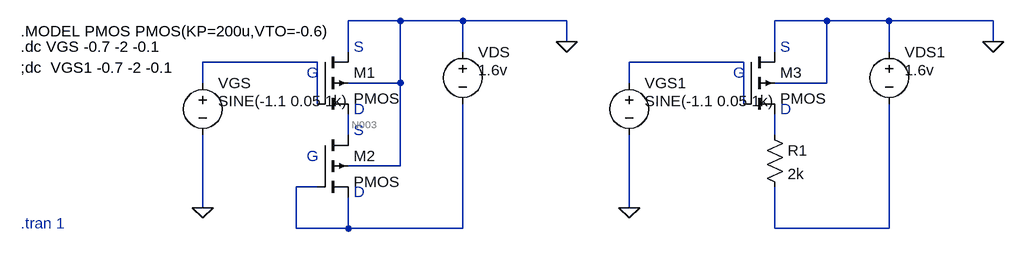
[diagram p0: schematic pmos-pmos.asc]
pmos-pmos.asc, the LTspice schematic file:
Version 4
SHEET 1 1188 680
WIRE 256 -16 176 -16
WIRE 352 -16 256 -16
WIRE 512 -16 352 -16
WIRE 912 -16 832 -16
WIRE 1008 -16 912 -16
WIRE 1168 -16 1008 -16
WIRE 512 16 512 -16
WIRE 1168 16 1168 -16
WIRE 176 32 176 -16
WIRE 352 32 352 -16
WIRE 832 32 832 -16
WIRE 1008 32 1008 -16
WIRE 128 48 -48 48
WIRE 784 48 608 48
WIRE -48 80 -48 48
WIRE 256 80 256 -16
WIRE 256 80 176 80
WIRE 608 80 608 48
WIRE 912 80 912 -16
WIRE 912 80 832 80
WIRE 128 112 128 48
WIRE 784 112 784 48
WIRE 176 160 176 128
WIRE 832 160 832 128
WIRE 256 208 256 80
WIRE 256 208 176 208
WIRE 128 240 96 240
WIRE -48 272 -48 160
WIRE 608 272 608 160
WIRE 96 304 96 240
WIRE 176 304 176 256
WIRE 176 304 96 304
WIRE 352 304 352 112
WIRE 352 304 176 304
WIRE 832 304 832 240
WIRE 1008 304 1008 112
WIRE 1008 304 832 304
FLAG -48 272 0
FLAG 512 16 0
FLAG 608 272 0
FLAG 1168 16 0
SYMBOL voltage 352 16 R0
WINDOW 123 0 0 Left 0
WINDOW 39 0 0 Left 0
WINDOW 3 24 44 Left 2
SYMATTR Value 1.6v
SYMATTR InstName VDS
SYMBOL voltage -48 64 R0
WINDOW 123 0 0 Left 0
WINDOW 39 0 0 Left 0
WINDOW 3 24 44 Left 2
SYMATTR Value SINE(-1.1 0.05 1k)
SYMATTR InstName VGS
SYMBOL pmos4 128 32 R0
SYMATTR InstName M1
SYMATTR Value2 l=1u w=10u
SYMBOL pmos4 128 160 R0
SYMATTR InstName M2
SYMATTR Value2 l=1u w=10u
SYMBOL voltage 1008 16 R0
WINDOW 123 0 0 Left 0
WINDOW 39 0 0 Left 0
WINDOW 3 24 44 Left 2
SYMATTR Value 1.6v
SYMATTR InstName VDS1
SYMBOL voltage 608 64 R0
WINDOW 123 0 0 Left 0
WINDOW 39 0 0 Left 0
WINDOW 3 24 44 Left 2
SYMATTR Value SINE(-1.1 0.05 1k)
SYMATTR InstName VGS1
SYMBOL pmos4 784 32 R0
SYMATTR InstName M3
SYMATTR Value2 l=1u w=10u
SYMBOL res 816 144 R0
SYMATTR InstName R1
SYMATTR Value 2k
TEXT 184 120 Left 2 ;D
TEXT 112 64 Left 2 ;G
TEXT 184 24 Left 2 ;S
TEXT -328 0 Left 2 !.MODEL PMOS PMOS(KP=200u,VTO=-0.6)
TEXT -328 24 Left 2 !.dc VGS -0.7 -2 -0.1
TEXT -328 296 Left 2 ;.tran 1
TEXT 184 248 Left 2 ;D
TEXT 112 192 Left 2 ;G
TEXT 184 152 Left 2 ;S
TEXT 840 120 Left 2 ;D
TEXT 768 64 Left 2 ;G
TEXT 840 24 Left 2 ;S
TEXT -328 56 Left 2 !;dc  VGS1 -0.7 -2 -0.1

The netlist it stands for:
* pmos-pmos.asc
VDS 0 N005 1.6v
VGS N001 0 SINE(-1.1 0.05 1k)
M1 0 N001 N003 0 PMOS l=1u w=10u
M2 N003 N005 N005 0 PMOS l=1u w=10u
VDS1 0 N006 1.6v
VGS1 N002 0 SINE(-1.1 0.05 1k)
M3 0 N002 N004 0 PMOS l=1u w=10u
R1 N004 N006 2k
.model NMOS NMOS
.model PMOS PMOS
.lib standard.mos
* D
* G
* S
.MODEL PMOS PMOS(KP=200u,VTO=-0.6)
.dc VGS -0.7 -2 -0.1
* .tran 1
* D
* G
* S
* D
* G
* S
;dc  VGS1 -0.7 -2 -0.1
.backanno
.end

* Results of the author's LTspice run, read from the files saved beside the schematic
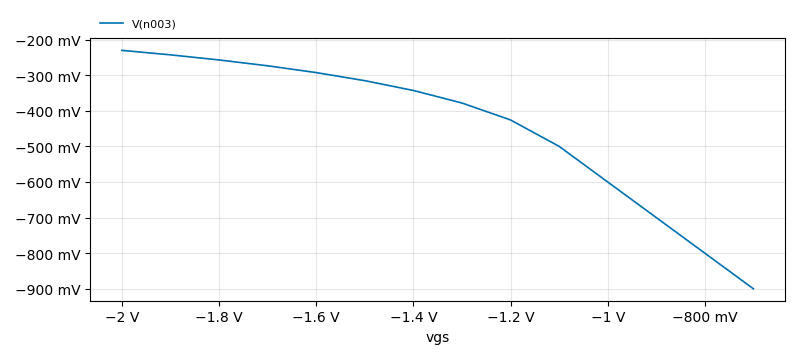
[diagram p1: DC transfer characteristic of pmos-pmos.asc, plotted from the saved traces]
* DC transfer characteristic, 1 run:
*   V(n003): -900 mV at vgs=-700 mV, -230.5 mV at vgs=-2 V, min -900 mV, max -230.5 mV